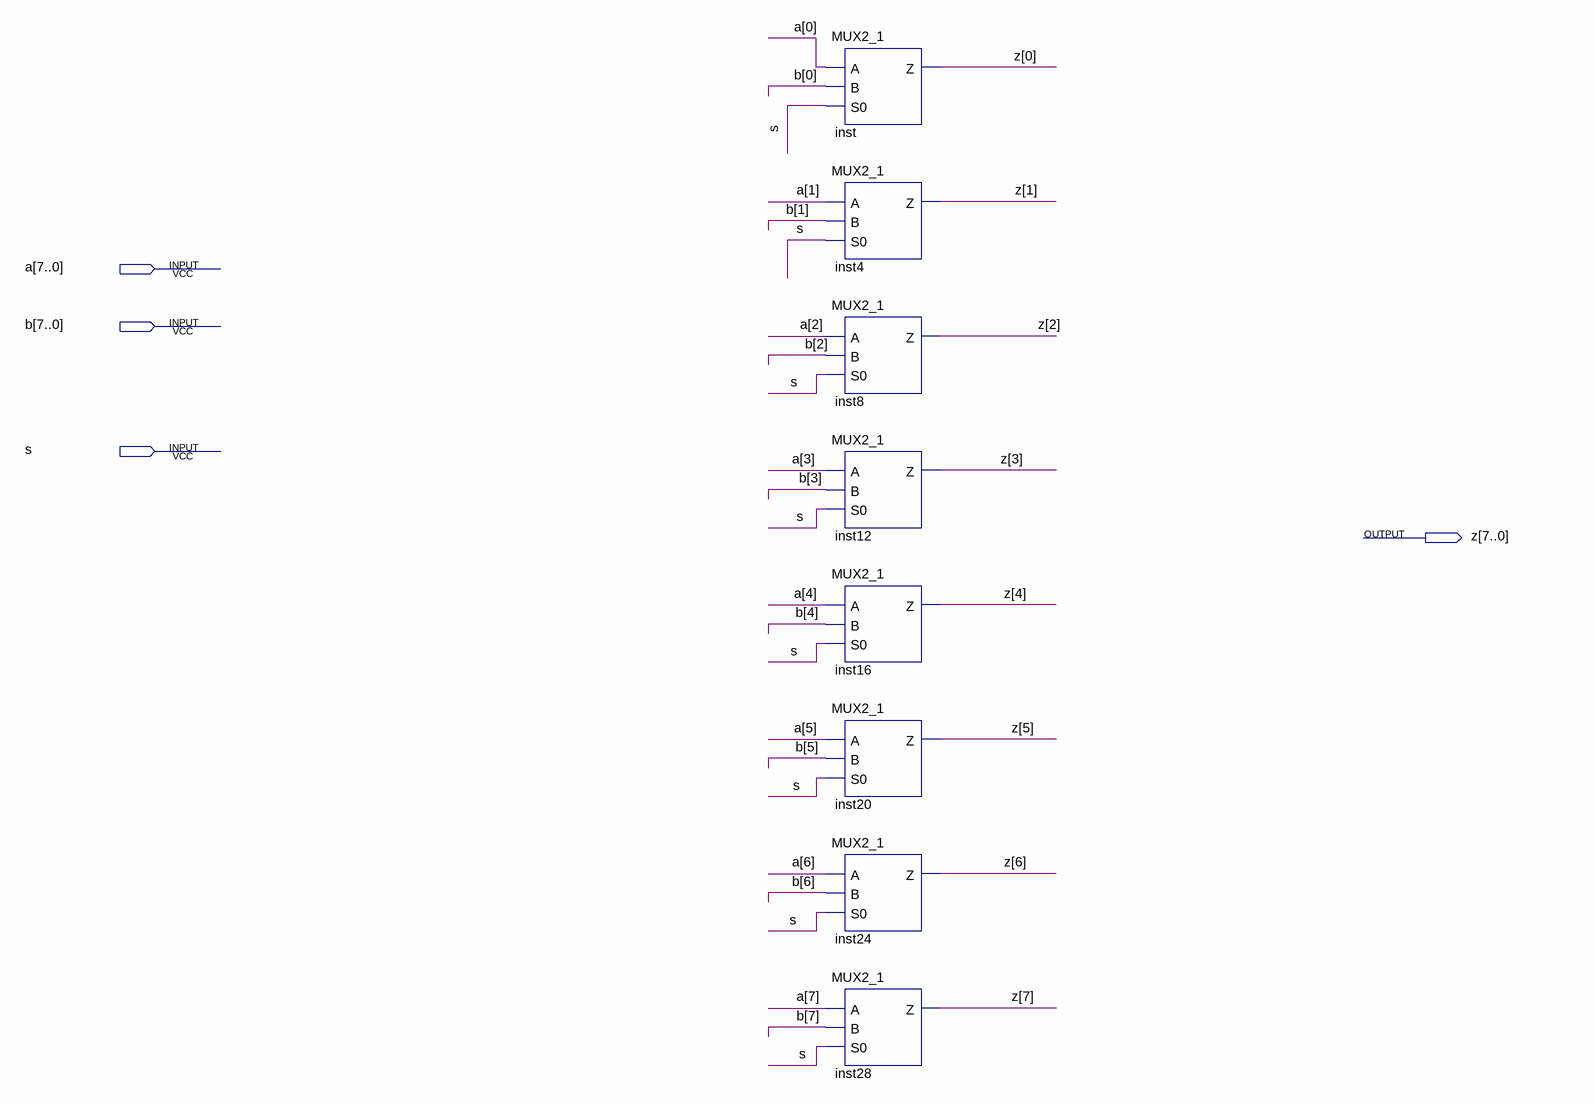
[diagram p0: schematic sheet]
// Quartus schematic MUX_LAB2.bdf as structural Verilog: 8 symbols, 4 pins
module MUX_LAB2 (
  input  [7:0] a,
  input  [7:0] b,
  input  s,
  output [7:0] z
);

  MUX2_1 inst (.A(a[0]), .B(b[0]), .S0(s), .Z(z[0]));
  MUX2_1 inst4 (.A(a[1]), .B(b[1]), .S0(s), .Z(z[1]));
  MUX2_1 inst8 (.A(a[2]), .B(b[2]), .S0(s), .Z(z[2]));
  MUX2_1 inst12 (.A(a[3]), .B(b[3]), .S0(s), .Z(z[3]));
  MUX2_1 inst16 (.A(a[4]), .B(b[4]), .S0(s), .Z(z[4]));
  MUX2_1 inst20 (.A(a[5]), .B(b[5]), .S0(s), .Z(z[5]));
  MUX2_1 inst24 (.A(a[6]), .B(b[6]), .S0(s), .Z(z[6]));
  MUX2_1 inst28 (.A(a[7]), .B(b[7]), .S0(s), .Z(z[7]));
endmodule
